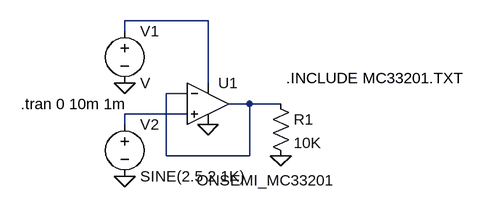
[diagram p0: schematic frontend.asc]
frontend.asc, the LTspice schematic file:
Version 4
SHEET 1 880 680
WIRE 208 32 80 32
WIRE 80 48 80 32
WIRE 208 128 208 32
WIRE 176 144 144 144
WIRE 272 160 240 160
WIRE 320 160 272 160
WIRE 176 176 80 176
WIRE 80 192 80 176
WIRE 144 240 144 144
WIRE 272 240 272 160
WIRE 272 240 144 240
FLAG 208 192 0
FLAG 80 272 0
FLAG 80 128 0
FLAG 320 240 0
SYMBOL Opamps\\UniversalOpamp2 208 160 R0
WINDOW 123 -17 118 Left 2
SYMATTR InstName U1
SYMATTR Value2 ONSEMI_MC33201
SYMBOL voltage 80 32 R0
SYMATTR InstName V1
SYMBOL voltage 80 176 R0
WINDOW 123 0 0 Left 2
WINDOW 39 0 0 Left 2
SYMATTR InstName V2
SYMATTR Value SINE(2.5 2 1K)
SYMBOL res 304 144 R0
SYMATTR InstName R1
SYMATTR Value 10K
TEXT 328 120 Left 2 !.INCLUDE MC33201.TXT
TEXT -80 160 Left 2 !.tran 0 10m 1m

The netlist it stands for:
* frontend.asc
XU1 N003 N002 N001 0 N002 level.2 ONSEMI_MC33201 ilimit=25m rail=0 Vos=0 phimargin=45 en=0 enk=0 in=0 ink=0 Rin=500Meg  ; pins IN+ IN- V+ V- OUT
V1 N001 0 V
V2 N003 0 SINE(2.5 2 1K)
R1 N002 0 10K
.INCLUDE MC33201.TXT
.tran 0 10m 1m
.lib UniversalOpamps2.sub
.backanno
.end